# Altium schematic sheet [04] - FMCP_3&4.SchDoc
size A3; DocumentNumber: 11; SheetNumber: 11; SheetTotal: 14
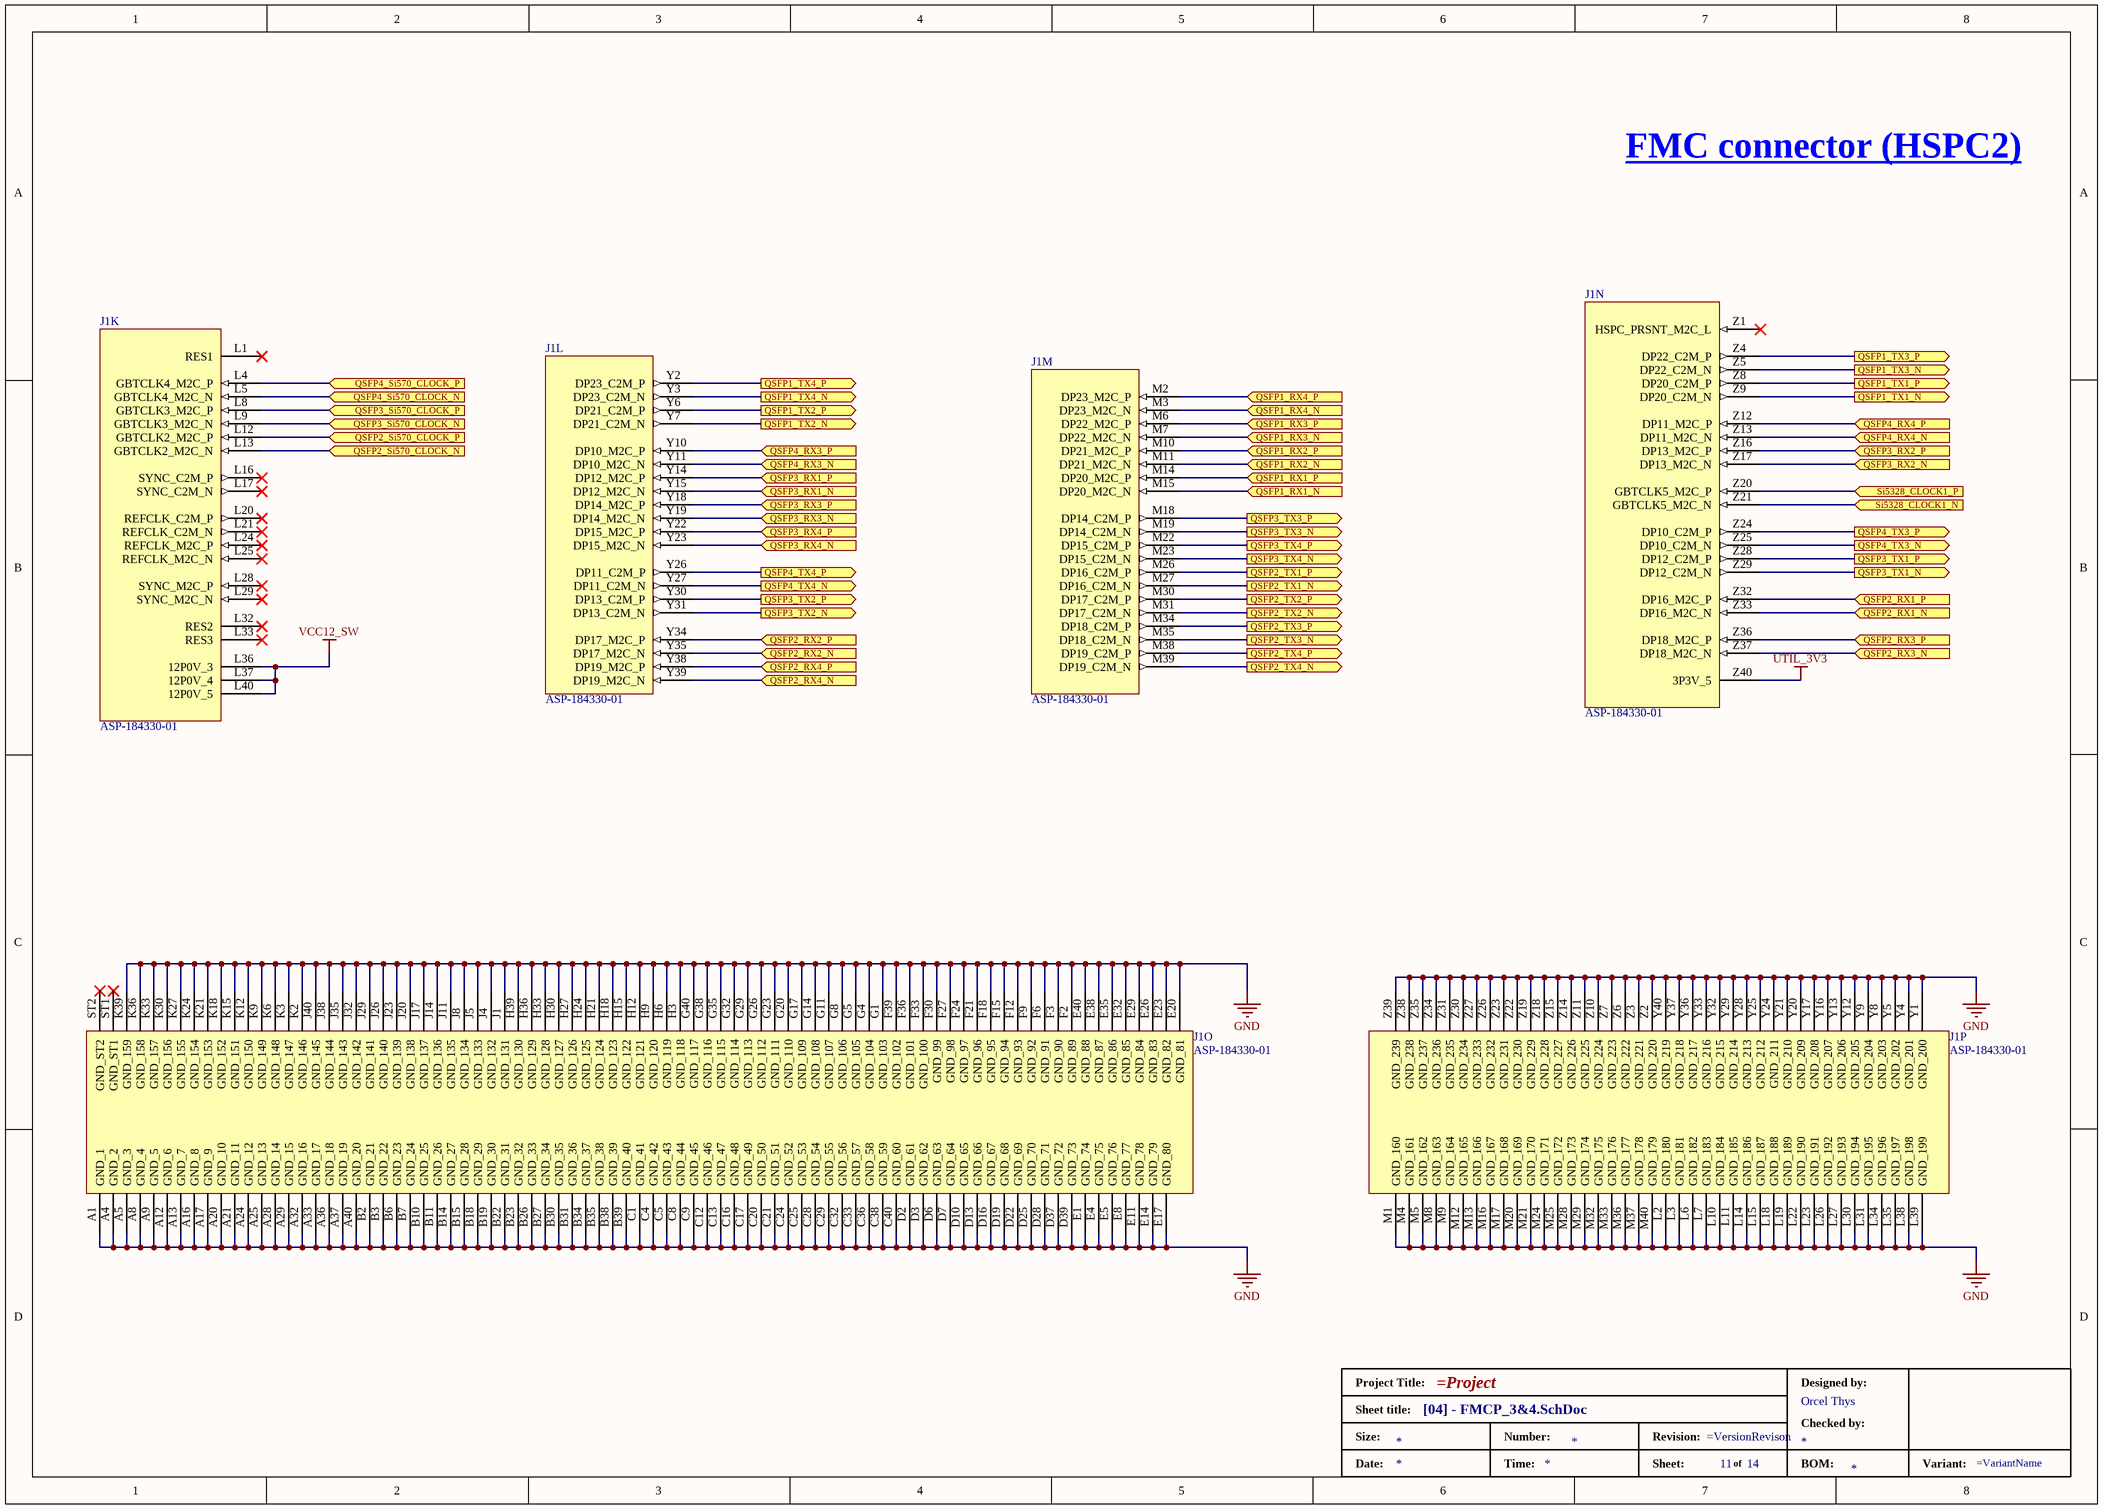
[diagram p0: [04] - FMCP_3&4.SchDoc]

## Parts
*  DesignedBy: Orcel Thys  (hidden comment: Standard Title Block)  (graphical)
J1  FMCP HSPC  [SAMTEC_ASP-184330-01]  (value not drawn)  (parts K,L,M,N,O,P of 16)

## Ports
QSFP1_RX1_N (in), QSFP1_RX1_P (in), QSFP1_RX2_N (in), QSFP1_RX2_P (in), QSFP1_RX3_N (in), QSFP1_RX3_P (in), QSFP1_RX4_N (in), QSFP1_RX4_P (in), QSFP1_TX1_N (out), QSFP1_TX1_P (out), QSFP1_TX2_N (out), QSFP1_TX2_P (out), QSFP1_TX3_N (out), QSFP1_TX3_P (out), QSFP1_TX4_N (out), QSFP1_TX4_P (out), QSFP2_RX1_N (in), QSFP2_RX1_P (in), QSFP2_RX2_N (in), QSFP2_RX2_P (in), QSFP2_RX3_N (in), QSFP2_RX3_P (in), QSFP2_RX4_N (in), QSFP2_RX4_P (in), QSFP2_Si570_CLOCK_N (in), QSFP2_Si570_CLOCK_P (in), QSFP2_TX1_N (out), QSFP2_TX1_P (out), QSFP2_TX2_N (out), QSFP2_TX2_P (out), QSFP2_TX3_N (out), QSFP2_TX3_P (out), QSFP2_TX4_N (out), QSFP2_TX4_P (out), QSFP3_RX1_N (in), QSFP3_RX1_P (in), QSFP3_RX2_N (in), QSFP3_RX2_P (in), QSFP3_RX3_N (in), QSFP3_RX3_P (in), QSFP3_RX4_N (in), QSFP3_RX4_P (in), QSFP3_Si570_CLOCK_N (in), QSFP3_Si570_CLOCK_P (in), QSFP3_TX1_N (out), QSFP3_TX1_P (out), QSFP3_TX2_N (out), QSFP3_TX2_P (out), QSFP3_TX3_N (out), QSFP3_TX3_P (out), QSFP3_TX4_N (out), QSFP3_TX4_P (out), QSFP4_RX3_N (in), QSFP4_RX3_P (in), QSFP4_RX4_N (in), QSFP4_RX4_P (in), QSFP4_Si570_CLOCK_N (in), QSFP4_Si570_CLOCK_P (in), QSFP4_TX3_N (out), QSFP4_TX3_P (out), QSFP4_TX4_N (out), QSFP4_TX4_P (out), Si5328_CLOCK1_N (in), Si5328_CLOCK1_P (in)

## Nets
GND: J1.A1(GND_1) J1.A4(GND_2) J1.A5(GND_3) J1.A8(GND_4) J1.A9(GND_5) J1.A12(GND_6) J1.A13(GND_7) J1.A16(GND_8) J1.A17(GND_9) J1.A20(GND_10) J1.A21(GND_11) J1.A24(GND_12) J1.A25(GND_13) J1.A28(GND_14) J1.A29(GND_15) J1.A32(GND_16) J1.A33(GND_17) J1.A36(GND_18) J1.A37(GND_19) J1.A40(GND_20) J1.B2(GND_21) J1.B3(GND_22) J1.B6(GND_23) J1.B7(GND_24) J1.B10(GND_25) J1.B11(GND_26) J1.B14(GND_27) J1.B15(GND_28) J1.B18(GND_29) J1.B19(GND_30) J1.B22(GND_31) J1.B23(GND_32) J1.B26(GND_33) J1.B27(GND_34) J1.B30(GND_35) J1.B31(GND_36) J1.B34(GND_37) J1.B35(GND_38) J1.B38(GND_39) J1.B39(GND_40) J1.C1(GND_41) J1.C4(GND_42) J1.C5(GND_43) J1.C8(GND_44) J1.C9(GND_45) J1.C12(GND_46) J1.C13(GND_47) J1.C16(GND_48) J1.C17(GND_49) J1.C20(GND_50) J1.C21(GND_51) J1.C24(GND_52) J1.C25(GND_53) J1.C28(GND_54) J1.C29(GND_55) J1.C32(GND_56) J1.C33(GND_57) J1.C36(GND_58) J1.C38(GND_59) J1.C40(GND_60) J1.D2(GND_61) J1.D3(GND_62) J1.D6(GND_63) J1.D7(GND_64) J1.D10(GND_65) J1.D13(GND_66) J1.D16(GND_67) J1.D19(GND_68) J1.D22(GND_69) J1.D25(GND_70) J1.D28(GND_71) J1.D37(GND_72) J1.D39(GND_73) J1.E1(GND_74) J1.E4(GND_75) J1.E5(GND_76) J1.E8(GND_77) J1.E11(GND_78) J1.E14(GND_79) J1.E17(GND_80) J1.E20(GND_81) J1.E23(GND_82) J1.E26(GND_83) J1.E29(GND_84) J1.E32(GND_85) J1.E35(GND_86) J1.E38(GND_87) J1.E40(GND_88) J1.F2(GND_89) J1.F3(GND_90) J1.F6(GND_91) J1.F9(GND_92) J1.F12(GND_93) J1.F15(GND_94) J1.F18(GND_95) J1.F21(GND_96) J1.F24(GND_97) J1.F27(GND_98) J1.F30(GND_99) J1.F33(GND_100) J1.F36(GND_101) J1.F39(GND_102) J1.G1(GND_103) J1.G4(GND_104) J1.G5(GND_105) J1.G8(GND_106) J1.G11(GND_107) J1.G14(GND_108) J1.G17(GND_109) J1.G20(GND_110) J1.G23(GND_111) J1.G26(GND_112) J1.G29(GND_113) J1.G32(GND_114) J1.G35(GND_115) J1.G38(GND_116) J1.G40(GND_117) J1.H3(GND_118) J1.H6(GND_119) J1.H9(GND_120) J1.H12(GND_121) J1.H15(GND_122) J1.H18(GND_123) J1.H21(GND_124) J1.H24(GND_125) J1.H27(GND_126) J1.H30(GND_127) J1.H33(GND_128) J1.H36(GND_129) J1.H39(GND_130) J1.J1(GND_131) J1.J4(GND_132) J1.J5(GND_133) J1.J8(GND_134) J1.J11(GND_135) J1.J14(GND_136) J1.J17(GND_137) J1.J20(GND_138) J1.J23(GND_139) J1.J26(GND_140) J1.J29(GND_141) J1.J32(GND_142) J1.J35(GND_143) J1.J38(GND_144) J1.J40(GND_145) J1.K2(GND_146) J1.K3(GND_147) J1.K6(GND_148) J1.K9(GND_149) J1.K12(GND_150) J1.K15(GND_151) J1.K18(GND_152) J1.K21(GND_153) J1.K24(GND_154) J1.K27(GND_155) J1.K30(GND_156) J1.K33(GND_157) J1.K36(GND_158) J1.K39(GND_159) J1.L2(GND_180) J1.L3(GND_181) J1.L6(GND_182) J1.L7(GND_183) J1.L10(GND_184) J1.L11(GND_185) J1.L14(GND_186) J1.L15(GND_187) J1.L18(GND_188) J1.L19(GND_189) J1.L22(GND_190) J1.L23(GND_191) J1.L26(GND_192) J1.L27(GND_193) J1.L30(GND_194) J1.L31(GND_195) J1.L34(GND_196) J1.L35(GND_197) J1.L38(GND_198) J1.L39(GND_199) J1.M1(GND_160) J1.M4(GND_161) J1.M5(GND_162) J1.M8(GND_163) J1.M9(GND_164) J1.M12(GND_165) J1.M13(GND_166) J1.M16(GND_167) J1.M17(GND_168) J1.M20(GND_169) J1.M21(GND_170) J1.M24(GND_171) J1.M25(GND_172) J1.M28(GND_173) J1.M29(GND_174) J1.M32(GND_175) J1.M33(GND_176) J1.M36(GND_177) J1.M37(GND_178) J1.M40(GND_179) J1.Y1(GND_200) J1.Y4(GND_201) J1.Y5(GND_202) J1.Y8(GND_203) J1.Y9(GND_204) J1.Y12(GND_205) J1.Y13(GND_206) J1.Y16(GND_207) J1.Y17(GND_208) J1.Y20(GND_209) J1.Y21(GND_210) J1.Y24(GND_211) J1.Y25(GND_212) J1.Y28(GND_213) J1.Y29(GND_214) J1.Y32(GND_215) J1.Y33(GND_216) J1.Y36(GND_217) J1.Y37(GND_218) J1.Y40(GND_219) J1.Z2(GND_220) J1.Z3(GND_221) J1.Z6(GND_222) J1.Z7(GND_223) J1.Z10(GND_224) J1.Z11(GND_225) J1.Z14(GND_226) J1.Z15(GND_227) J1.Z18(GND_228) J1.Z19(GND_229) J1.Z22(GND_230) J1.Z23(GND_231) J1.Z26(GND_232) J1.Z27(GND_233) J1.Z30(GND_234) J1.Z31(GND_235) J1.Z34(GND_236) J1.Z35(GND_237) J1.Z38(GND_238) J1.Z39(GND_239)
UTIL_3V3: J1.Z40(3P3V_5)
VCC12_SW: J1.L36(12P0V_3) J1.L37(12P0V_4) J1.L40(12P0V_5)
QSFP1_RX1_N: J1.M15(DP20_M2C_N) ; port QSFP1_RX1_N
QSFP1_RX1_P: J1.M14(DP20_M2C_P) ; port QSFP1_RX1_P
QSFP1_RX2_N: J1.M11(DP21_M2C_N) ; port QSFP1_RX2_N
QSFP1_RX2_P: J1.M10(DP21_M2C_P) ; port QSFP1_RX2_P
QSFP1_RX3_N: J1.M7(DP22_M2C_N) ; port QSFP1_RX3_N
QSFP1_RX3_P: J1.M6(DP22_M2C_P) ; port QSFP1_RX3_P
QSFP1_RX4_N: J1.M3(DP23_M2C_N) ; port QSFP1_RX4_N
QSFP1_RX4_P: J1.M2(DP23_M2C_P) ; port QSFP1_RX4_P
QSFP1_TX1_N: J1.Z9(DP20_C2M_N) ; port QSFP1_TX1_N
QSFP1_TX1_P: J1.Z8(DP20_C2M_P) ; port QSFP1_TX1_P
QSFP1_TX2_N: J1.Y7(DP21_C2M_N) ; port QSFP1_TX2_N
QSFP1_TX2_P: J1.Y6(DP21_C2M_P) ; port QSFP1_TX2_P
QSFP1_TX3_N: J1.Z5(DP22_C2M_N) ; port QSFP1_TX3_N
QSFP1_TX3_P: J1.Z4(DP22_C2M_P) ; port QSFP1_TX3_P
QSFP1_TX4_N: J1.Y3(DP23_C2M_N) ; port QSFP1_TX4_N
QSFP1_TX4_P: J1.Y2(DP23_C2M_P) ; port QSFP1_TX4_P
QSFP2_RX1_N: J1.Z33(DP16_M2C_N) ; port QSFP2_RX1_N
QSFP2_RX1_P: J1.Z32(DP16_M2C_P) ; port QSFP2_RX1_P
QSFP2_RX2_N: J1.Y35(DP17_M2C_N) ; port QSFP2_RX2_N
QSFP2_RX2_P: J1.Y34(DP17_M2C_P) ; port QSFP2_RX2_P
QSFP2_RX3_N: J1.Z37(DP18_M2C_N) ; port QSFP2_RX3_N
QSFP2_RX3_P: J1.Z36(DP18_M2C_P) ; port QSFP2_RX3_P
QSFP2_RX4_N: J1.Y39(DP19_M2C_N) ; port QSFP2_RX4_N
QSFP2_RX4_P: J1.Y38(DP19_M2C_P) ; port QSFP2_RX4_P
QSFP2_Si570_CLOCK_N: J1.L13(GBTCLK2_M2C_N) ; port QSFP2_Si570_CLOCK_N
QSFP2_Si570_CLOCK_P: J1.L12(GBTCLK2_M2C_P) ; port QSFP2_Si570_CLOCK_P
QSFP2_TX1_N: J1.M27(DP16_C2M_N) ; port QSFP2_TX1_N
QSFP2_TX1_P: J1.M26(DP16_C2M_P) ; port QSFP2_TX1_P
QSFP2_TX2_N: J1.M31(DP17_C2M_N) ; port QSFP2_TX2_N
QSFP2_TX2_P: J1.M30(DP17_C2M_P) ; port QSFP2_TX2_P
QSFP2_TX3_N: J1.M35(DP18_C2M_N) ; port QSFP2_TX3_N
QSFP2_TX3_P: J1.M34(DP18_C2M_P) ; port QSFP2_TX3_P
QSFP2_TX4_N: J1.M39(DP19_C2M_N) ; port QSFP2_TX4_N
QSFP2_TX4_P: J1.M38(DP19_C2M_P) ; port QSFP2_TX4_P
QSFP3_RX1_N: J1.Y15(DP12_M2C_N) ; port QSFP3_RX1_N
QSFP3_RX1_P: J1.Y14(DP12_M2C_P) ; port QSFP3_RX1_P
QSFP3_RX2_N: J1.Z17(DP13_M2C_N) ; port QSFP3_RX2_N
QSFP3_RX2_P: J1.Z16(DP13_M2C_P) ; port QSFP3_RX2_P
QSFP3_RX3_N: J1.Y19(DP14_M2C_N) ; port QSFP3_RX3_N
QSFP3_RX3_P: J1.Y18(DP14_M2C_P) ; port QSFP3_RX3_P
QSFP3_RX4_N: J1.Y23(DP15_M2C_N) ; port QSFP3_RX4_N
QSFP3_RX4_P: J1.Y22(DP15_M2C_P) ; port QSFP3_RX4_P
QSFP3_Si570_CLOCK_N: J1.L9(GBTCLK3_M2C_N) ; port QSFP3_Si570_CLOCK_N
QSFP3_Si570_CLOCK_P: J1.L8(GBTCLK3_M2C_P) ; port QSFP3_Si570_CLOCK_P
QSFP3_TX1_N: J1.Z29(DP12_C2M_N) ; port QSFP3_TX1_N
QSFP3_TX1_P: J1.Z28(DP12_C2M_P) ; port QSFP3_TX1_P
QSFP3_TX2_N: J1.Y31(DP13_C2M_N) ; port QSFP3_TX2_N
QSFP3_TX2_P: J1.Y30(DP13_C2M_P) ; port QSFP3_TX2_P
QSFP3_TX3_N: J1.M19(DP14_C2M_N) ; port QSFP3_TX3_N
QSFP3_TX3_P: J1.M18(DP14_C2M_P) ; port QSFP3_TX3_P
QSFP3_TX4_N: J1.M23(DP15_C2M_N) ; port QSFP3_TX4_N
QSFP3_TX4_P: J1.M22(DP15_C2M_P) ; port QSFP3_TX4_P
QSFP4_RX3_N: J1.Y11(DP10_M2C_N) ; port QSFP4_RX3_N
QSFP4_RX3_P: J1.Y10(DP10_M2C_P) ; port QSFP4_RX3_P
QSFP4_RX4_N: J1.Z13(DP11_M2C_N) ; port QSFP4_RX4_N
QSFP4_RX4_P: J1.Z12(DP11_M2C_P) ; port QSFP4_RX4_P
QSFP4_Si570_CLOCK_N: J1.L5(GBTCLK4_M2C_N) ; port QSFP4_Si570_CLOCK_N
QSFP4_Si570_CLOCK_P: J1.L4(GBTCLK4_M2C_P) ; port QSFP4_Si570_CLOCK_P
QSFP4_TX3_N: J1.Z25(DP10_C2M_N) ; port QSFP4_TX3_N
QSFP4_TX3_P: J1.Z24(DP10_C2M_P) ; port QSFP4_TX3_P
QSFP4_TX4_N: J1.Y27(DP11_C2M_N) ; port QSFP4_TX4_N
QSFP4_TX4_P: J1.Y26(DP11_C2M_P) ; port QSFP4_TX4_P
Si5328_CLOCK1_N: J1.Z21(GBTCLK5_M2C_N) ; port Si5328_CLOCK1_N
Si5328_CLOCK1_P: J1.Z20(GBTCLK5_M2C_P) ; port Si5328_CLOCK1_P

Not connected (* = marked no-connect by the designer): J1 L1(RES1)* L16(SYNC_C2M_P)* L17(SYNC_C2M_N)* L20(REFCLK_C2M_P)* L21(REFCLK_C2M_N)* L24(REFCLK_M2C_P)* L25(REFCLK_M2C_N)* L28(SYNC_M2C_P)* L29(SYNC_M2C_N)* L32(RES2)* L33(RES3)* ST1(GND_ST1)* ST2(GND_ST2)* Z1(HSPC_PRSNT_M2C_L)*

## Notes on the sheet
- FMC connector (HSPC2)
- Title
- Size:
- Date:
- A4
- Number:
- Time:
- Revision:
- Sheet
- of
- File:
- (in symbol Title_Block) Project Title:; Designed by:; Sheet title:; Checked by:; Size:; Number:; Revision:; Date:; Time:; Sheet:; of; BOM:; Variant:

## Library data of the parts
* = Title_Block: Size: *; BOM: *; DW: *; CheckedBy: *
J1 = ASP-184330-01: Male Conn Open Pin Field Array PIN 560 POS 1.27mm Solder ST Top Entry SMD; Manufacturer: Samtec; Mated Stacking Heights: 11.5mm; Supplier 1: Arrow Electronics; Manufacturer Part Number: ASP-184330-01; RoHS: Yes; Category: Board to Board Connectors; Stock 1: 75; Pricing 1: 1=47.84, 10=45.01, 25=42.16 (USD); Mount: Surface Mount; Contact Plating: Gold; Packaging: Strip; Number of Rows: 14; ComponentLink1URL: http://suddendocs.samtec.com/prints/asp-184330-01-mkt.pdf?src-supplier=Digi-Key; ComponentLink1Description: http://suddendocs.samtec.com/prints/asp-184330-01-mkt.pdf?src-supplier=Digi-Key; ComponentLink2URL: http://datasheet.octopart.com/ASP-184330-01-Samtec-datasheet-137321575.pdf?src-supplier=Rs; ComponentLink2Description: http://datasheet.octopart.com/ASP-184330-01-Samtec-datasheet-137321575.pdf?src-supplier=Rs; Supplier Part Number 1: ASP-184330-01